# Altium project tetris.PrjPcb
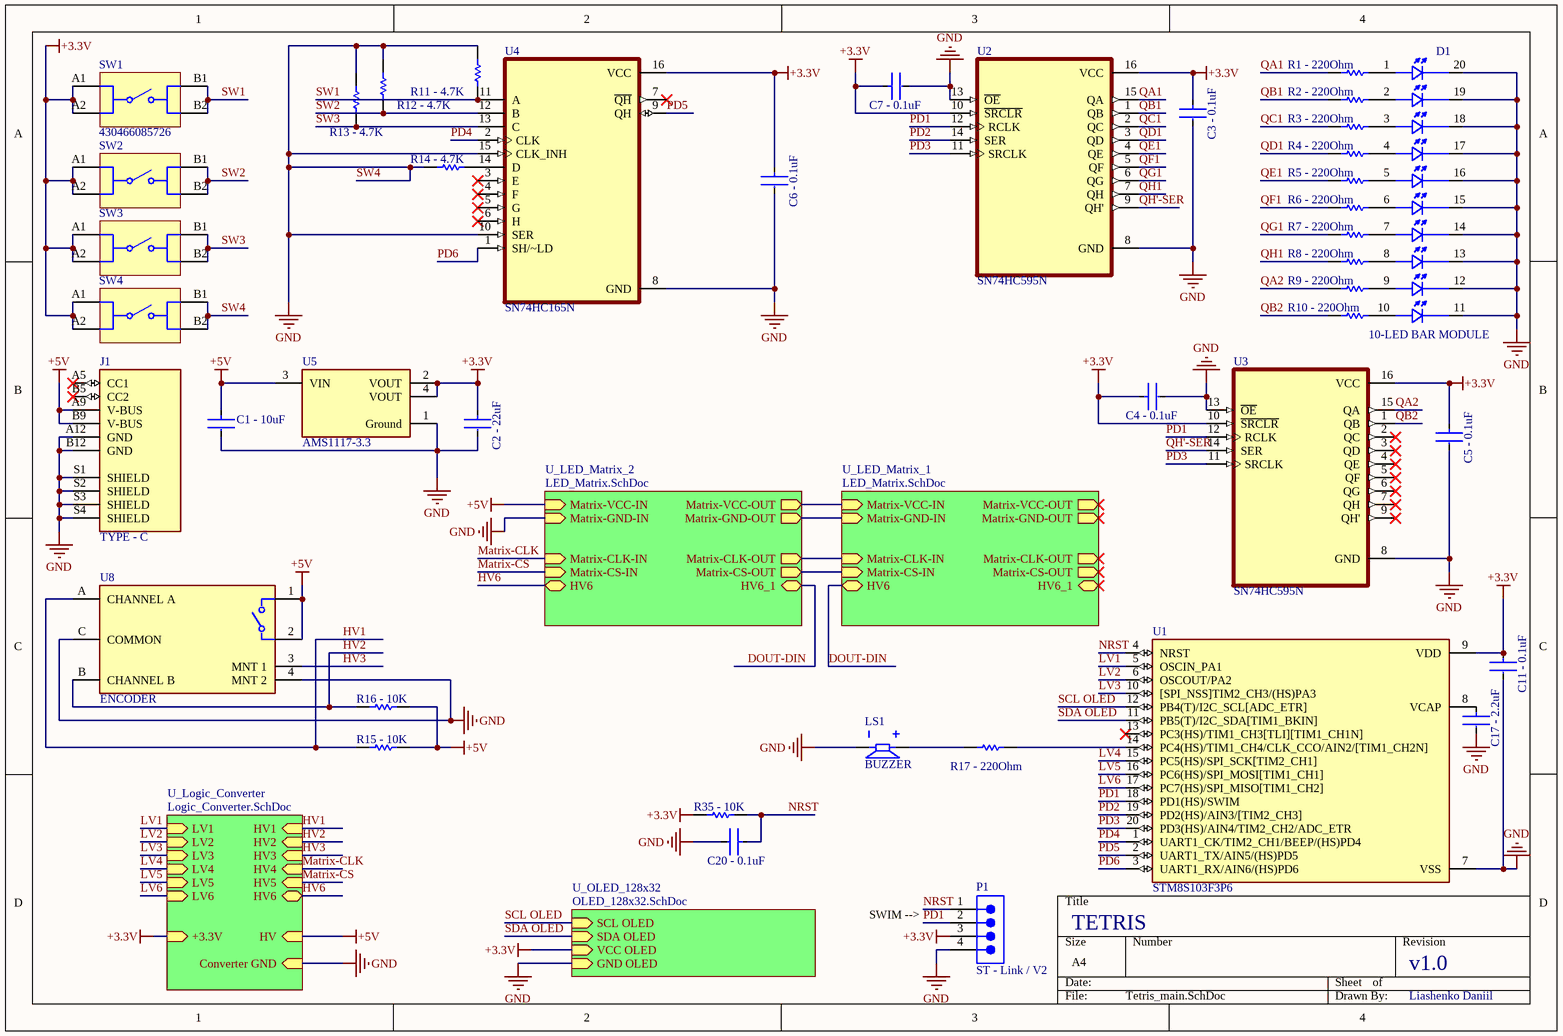
[diagram p0: Tetris_main.SchDoc]
4 sheets, 85 parts. Net scope: hierarchical (ports join the sheet entries above them; power ports are global).
Sheets:
  Tetris_main.SchDoc
    U_Logic_Converter = Logic_Converter.SchDoc
    U_OLED_128x32 = OLED_128x32.SchDoc
    U_LED_Matrix_1 = LED_Matrix.SchDoc
    U_LED_Matrix_2 = LED_Matrix.SchDoc

## Sheet Tetris_main.SchDoc
size A4; SheetNumber: 1; SheetTotal: 4

### Parts
C1_-_10uF  GRM188R60J106ME47D  [FP-GRM188-0_1-e0_2_0_55-IPC_A]  (value not drawn)
C2_-_22uF  CC0603MRX5R5BB226  [FP-CC0603-DC-MFG]  (value not drawn)
C3_-_0.1uF  CC0603KRX7R7BB104  [FP-CC0603-DA-MFG]  (value not drawn)
C4_-_0.1uF  CC0603KRX7R7BB104  [FP-CC0603-DA-MFG]  (value not drawn)
C5_-_0.1uF  CC0603KRX7R7BB104  [FP-CC0603-DA-MFG]  (value not drawn)
C6_-_0.1uF  CC0603KRX7R7BB104  [FP-CC0603-DA-MFG]  (value not drawn)
C7_-_0.1uF  CC0603KRX7R7BB104  [FP-CC0603-DA-MFG]  (value not drawn)
C11_-_0.1uF  CC0603KRX7R7BB104  [FP-CC0603-DA-MFG]  (value not drawn)
C17_-_2.2uF  CC0805KKX7R7BB105  [FP-CC0805-0_85-MFG]  (value not drawn)
C20_-_0.1uF  CC0603KRX7R7BB104  [FP-CC0603-DA-MFG]  (value not drawn)
D1  10-LED BAR MODULE  [DIP750W50P254L2540H825Q20]
J1  TYPE - C  [CUI_UJC-HP-3-SMT-TR]
LS1  BUZZER  [XDCR_CPI-148-24-90T-67]
P1  ST - Link / V2  [61300411021]
R1_-_220Ohm  RC0402FR-13220RL  [RESC1005X40X25ML05T10]  (value not drawn)
R2_-_220Ohm  RC0402FR-13220RL  [RESC1005X40X25ML05T10]  (value not drawn)
R3_-_220Ohm  RC0402FR-13220RL  [RESC1005X40X25ML05T10]  (value not drawn)
R4_-_220Ohm  RC0402FR-13220RL  [RESC1005X40X25ML05T10]  (value not drawn)
R5_-_220Ohm  RC0402FR-13220RL  [RESC1005X40X25ML05T10]  (value not drawn)
R6_-_220Ohm  RC0402FR-13220RL  [RESC1005X40X25ML05T10]  (value not drawn)
R7_-_220Ohm  RC0402FR-13220RL  [RESC1005X40X25ML05T10]  (value not drawn)
R8_-_220Ohm  RC0402FR-13220RL  [RESC1005X40X25ML05T10]  (value not drawn)
R9_-_220Ohm  RC0402FR-13220RL  [RESC1005X40X25ML05T10]  (value not drawn)
R10_-_220Ohm  RC0402FR-13220RL  [RESC1005X40X25ML05T10]  (value not drawn)
R11_-_4.7K  RC0603JR-074K7L  [RESC1608X55X25ML10T15]  (value not drawn)
R12_-_4.7K  RC0603JR-074K7L  [RESC1608X55X25ML10T15]  (value not drawn)
R13_-_4.7K  RC0603JR-074K7L  [RESC1608X55X25ML10T15]  (value not drawn)
R14_-_4.7K  RC0603JR-074K7L  [RESC1608X55X25ML10T15]  (value not drawn)
R15_-_10K  RC0603JR-074K7L  [RESC1608X55X25ML10T15]  (value not drawn)
R16_-_10K  RC0603JR-074K7L  [RESC1608X55X25ML10T15]  (value not drawn)
R17_-_220Ohm  RC0402FR-13220RL  [RESC1005X40X25ML05T10]  (value not drawn)
R35_-_10K  RC0603JR-074K7L  [RESC1608X55X25ML10T15]  (value not drawn)
SW1  430466085726  [430466085726]
SW2  430466085726  [430466085726]  (value not drawn)
SW3  430466085726  [430466085726]  (value not drawn)
SW4  430466085726  [430466085726]  (value not drawn)
U1  STM8S103F3P6  [SOP65P640X120-20N]
U2  SN74HC595N  [DIP794W45P254L1969H508Q16]
U3  SN74HC595N  [DIP794W45P254L1969H508Q16]
U4  SN74HC165N  [DIP794W45P254L1969H508Q16]
U5  AMS1117-3.3  [FP-AMS1117-IPC_B]
U8  ENCODER  [FP-PEC11R-4115F-S0018-MFG]

### Sub-sheets
U_LED_Matrix_1 = LED_Matrix.SchDoc: Matrix-CLK-IN (in), Matrix-CS-IN (in), HV6 (bidir), HV6_1 (bidir), Matrix-GND-IN (in), Matrix-GND-OUT (out), Matrix-CLK-OUT (out), Matrix-CS-OUT (out), Matrix-VCC-IN (in), Matrix-VCC-OUT (out)
U_LED_Matrix_2 = LED_Matrix.SchDoc: Matrix-CLK-IN (in), Matrix-CS-IN (in), HV6 (bidir), HV6_1 (bidir), Matrix-GND-IN (in), Matrix-GND-OUT (out), Matrix-CLK-OUT (out), Matrix-CS-OUT (out), Matrix-VCC-IN (in), Matrix-VCC-OUT (out)
U_Logic_Converter = Logic_Converter.SchDoc: LV1 (in), HV1 (in), LV2 (in), HV2 (in), LV3 (in), HV3 (in), LV4 (in), HV4 (in), LV5 (in), HV5 (in), LV6 (in), HV6 (bidir), +3.3V (in), HV (in), Converter GND (in)
U_OLED_128x32 = OLED_128x32.SchDoc: SCL OLED (in), SDA OLED (in), VCC OLED (in), GND OLED (in)

### Nets
+3.3V: C1_-_10uF.1 C2_-_22uF.1 C3_-_0.1uF.1 C4_-_0.1uF.1 C5_-_0.1uF.1 C6_-_0.1uF.1 C7_-_0.1uF.1 C11_-_0.1uF.1 J1.A9(V-BUS) J1.B9(V-BUS) P1.3 R15_-_10K.2 R16_-_10K.2 R35_-_10K.1 SW1.A1 SW1.A2 SW2.A1 SW2.A2 SW3.A1 SW3.A2 SW4.A1 SW4.A2 U1.9(VDD) U2.10(~{SRCLR}) U2.16(VCC) U3.10(~{SRCLR}) U3.16(VCC) U4.16(VCC) U5.2(VOUT) U5.3(VIN) U5.4(VOUT) U8.1 U8.2 ; sheet U_Logic_Converter/+3.3V, sheet U_Logic_Converter/HV, sheet U_OLED_128x32/VCC OLED, sheet U_LED_Matrix_1/Matrix-VCC-IN, sheet U_LED_Matrix_1/Matrix-VCC-OUT, sheet U_LED_Matrix_2/Matrix-VCC-IN, sheet U_LED_Matrix_2/Matrix-VCC-OUT  [also labelled +5V]
GND: C1_-_10uF.2 C2_-_22uF.2 C3_-_0.1uF.2 C4_-_0.1uF.2 C5_-_0.1uF.2 C6_-_0.1uF.2 C7_-_0.1uF.2 C11_-_0.1uF.2 C17_-_2.2uF.2 C20_-_0.1uF.2 D1.11 D1.12 D1.13 D1.14 D1.15 D1.16 D1.17 D1.18 D1.19 D1.20 J1.A12(GND) J1.B12(GND) J1.S1(SHIELD) J1.S2(SHIELD) J1.S3(SHIELD) J1.S4(SHIELD) LS1.N P1.4 R11_-_4.7K.2 R12_-_4.7K.2 R13_-_4.7K.2 R14_-_4.7K.1 SW4.B1 SW4.B2 U1.7(VSS) U2.8(GND) U2.13(~{OE}) U3.8(GND) U3.13(~{OE}) U4.8(GND) U4.10(SER) U4.15(CLK_INH) U5.1(Ground) U8.4(MNT_2) U8.C(COMMON) ; sheet U_Logic_Converter/Converter GND, sheet U_OLED_128x32/GND OLED, sheet U_LED_Matrix_1/Matrix-GND-IN, sheet U_LED_Matrix_1/Matrix-GND-OUT, sheet U_LED_Matrix_2/Matrix-GND-IN, sheet U_LED_Matrix_2/Matrix-GND-OUT  [also labelled SW4]
HV1: R15_-_10K.1 U8.A(CHANNEL_A) ; sheet U_Logic_Converter/HV1
HV2: R16_-_10K.1 U8.B(CHANNEL_B) ; sheet U_Logic_Converter/HV2
HV3: U8.3(MNT_1) ; sheet U_Logic_Converter/HV3
HV6: sheet U_Logic_Converter/HV6, sheet U_LED_Matrix_2/HV6
LV1: U1.5(OSCIN_PA1) ; sheet U_Logic_Converter/LV1
LV2: U1.6(OSCOUT/PA2) ; sheet U_Logic_Converter/LV2
LV3: U1.10([SPI_NSS]TIM2_CH3/(HS)PA3) ; sheet U_Logic_Converter/LV3
LV4: U1.15(PC5(HS)/SPI_SCK[TIM2_CH1]) ; sheet U_Logic_Converter/LV4
LV5: U1.16(PC6(HS)/SPI_MOSI[TIM1_CH1]) ; sheet U_Logic_Converter/LV5
LV6: U1.17(PC7(HS)/SPI_MISO[TIM1_CH2]) ; sheet U_Logic_Converter/LV6
Matrix-CLK: sheet U_Logic_Converter/HV4, sheet U_LED_Matrix_1/Matrix-CLK-IN, sheet U_LED_Matrix_1/Matrix-CLK-OUT, sheet U_LED_Matrix_2/Matrix-CLK-IN, sheet U_LED_Matrix_2/Matrix-CLK-OUT
Matrix-CS: sheet U_Logic_Converter/HV5, sheet U_LED_Matrix_1/Matrix-CS-IN, sheet U_LED_Matrix_1/Matrix-CS-OUT, sheet U_LED_Matrix_2/Matrix-CS-IN, sheet U_LED_Matrix_2/Matrix-CS-OUT
NRST: C20_-_0.1uF.1 P1.1 R35_-_10K.2 U1.4(NRST)
PD1: P1.2 U1.18(PD1(HS)/SWIM) U2.12(RCLK) U3.12(RCLK)
PD2: U1.19(PD2(HS)/AIN3/[TIM2_CH3]) U2.14(SER)
PD3: U1.20(PD3(HS)/AIN4/TIM2_CH2/ADC_ETR) U2.11(SRCLK) U3.11(SRCLK)
PD4: U1.1(UART1_CK/TIM2_CH1/BEEP/(HS)PD4) U4.2(CLK)
PD5: U1.2(UART1_TX/AIN5/(HS)PD5) U4.9(QH)
PD6: U1.3(UART1_RX/AIN6/(HS)PD6) U4.1(SH/~LD)
QA1: R1_-_220Ohm.1 U2.15(QA)
QA2: R9_-_220Ohm.1 U3.15(QA)
QB1: R2_-_220Ohm.1 U2.1(QB)
QB2: R10_-_220Ohm.1 U3.1(QB)
QC1: R3_-_220Ohm.1 U2.2(QC)
QD1: R4_-_220Ohm.1 U2.3(QD)
QE1: R5_-_220Ohm.1 U2.4(QE)
QF1: R6_-_220Ohm.1 U2.5(QF)
QG1: R7_-_220Ohm.1 U2.6(QG)
QH1: R8_-_220Ohm.1 U2.7(QH)
QH'-SER: U2.9(QH') U3.14(SER)
SCL OLED: U1.12(PB4(T)/I2C_SCL[ADC_ETR]) ; sheet U_OLED_128x32/SCL OLED
SDA OLED: U1.11(PB5(T)/I2C_SDA[TIM1_BKIN]) ; sheet U_OLED_128x32/SDA OLED
SW1: R11_-_4.7K.1 SW1.B1 SW1.B2 U4.11(A)
SW2: R12_-_4.7K.1 SW2.B1 SW2.B2 U4.12(B)
SW3: R13_-_4.7K.1 SW3.B1 SW3.B2 U4.13(C)
NetC17_-_2.2uF_1: C17_-_2.2uF.1 U1.8(VCAP)
NetD1_1: D1.1 R1_-_220Ohm.2
NetD1_2: D1.2 R2_-_220Ohm.2
NetD1_3: D1.3 R3_-_220Ohm.2
NetD1_4: D1.4 R4_-_220Ohm.2
NetD1_5: D1.5 R5_-_220Ohm.2
NetD1_6: D1.6 R6_-_220Ohm.2
NetD1_7: D1.7 R7_-_220Ohm.2
NetD1_8: D1.8 R8_-_220Ohm.2
NetD1_9: D1.9 R9_-_220Ohm.2
NetD1_10: D1.10 R10_-_220Ohm.2
NetLS1_P: LS1.P R17_-_220Ohm.1
NetR14_-_4.7K_2: R14_-_4.7K.2 U4.14(D)
NetR17_-_220Ohm_2: R17_-_220Ohm.2 U1.14(PC4(HS)/TIM1_CH4/CLK_CCO/AIN2/[TIM1_CH2N])

Not connected (* = marked no-connect by the designer): J1 A5(CC1)* B5(CC2)*; U1 13(PC3(HS)/TIM1_CH3[TLI][TIM1_CH1N])*; U3 2(QC)* 3(QD)* 4(QE)* 5(QF)* 6(QG)* 7(QH)* 9(QH')*; U4 3(E)* 4(F)* 5(G)* 6(H)* 7(~{QH})*

### Notes on the sheet
- DOUT-DIN
- SWIM -->
- (near U1) TETRIS
- v1.0
- Liashenko Daniil

### Library data of the parts
C1_-_10uF = CMP-2006-02792-2: Chip Multilayer Ceramic Capacitors for General Purpose, 0603, 10uF, X5R, 15%, 20%, 6.3V; Packaging: Tape and Reel; Voltage Rating (DC): 6.3V; Width: 0.031inch; Termination: SMD/SMT; Dielectric: X5R; Package Quantity: 4000; Voltage Rating: 6.3V; Capacitance: 10uF; Case/Package: 0603; Min Operating Temperature: -55°C; Voltage: 6.3V; Length: 1.6mm; Thickness: 0.035inch; Lead Free: Lead Free; Depth: 0.8mm; Case Code (Imperial): 0603; Max Operating Temperature: 85°C; Material: Ceramic; Height: 0.8mm; Tolerance: 20%; Mount: Surface Mount; REACH SVHC: No SVHC; Radiation Hardening: No; Case Code (Metric): 1608
C2_-_22uF = CMP-2000-06075-2: CAP CER 22UF 6.3V X5R 0603; Tolerance: 20%; Termination: SMD/SMT; Mount: Surface Mount; Depth: 0.8mm; Thickness: 0.035inch; Packaging: Tape and Reel; RoHS Compliant: Yes; Case/Package: 0603; Min Operating Temperature: -55°C; Package Quantity: 4000; Weight: 7.1E-05oz; Max Operating Temperature: 85°C; Voltage Rating (DC): 6.3V; Halogen Free: Halogen Free; Lead Free: Lead Free; Resistor Type: Ceramic; Case Code (Imperial): 0603; Width: 0.031inch; Case Code (Metric): 1608; Voltage Rating: 6.3V; Length: 0.063inch; Capacitance: 22uF; Dielectric: X5R
C3_-_0.1uF C4_-_0.1uF C5_-_0.1uF C6_-_0.1uF C7_-_0.1uF C11_-_0.1uF C20_-_0.1uF = CMP-2000-05002-2: CAP CER 0.1UF 16V X7R 0603; Manufacturer: YAGEO; Tolerance: 0.1; Value: 100 nF; Temperature Coefficient: 15%; Material: Ceramic; Voltage Rating: 16 V; Package: CC0603-DA; ComponentLink2Description: Datasheet; Octopart: https://octopart.com/cc0603krx7r7bb104-yageo-192941; Temperature Range High: +125°C; Digikey Description: CAP CER 0.1UF 16V X7R 0603; Voltage: 16 V; Device Class L2: Capacitors; Height: 0.9mm; Temperature: -55°C to +125°C; Manufacturer Part Number: CC0603KRX7R7BB104; Device Class L1: Passive Components; Device Class L3: Ceramic Capacitors; ComponentLink2URL: http://www.yageo.com/documents/recent/UPY-GPHC_X7R_6.3V-to-50V_18.pdf; Footprint Url: http://www.yageo.com/exep/pages/download/literatures/UPY-C_GEN_24.pdf; RoHS: TRUE; Temperature Range Low: -55°C; Temperature Characteristic: X7R; Lead Free: Yes; Capacitance: 100 nF; Category: Cap; Mouser Description: Multilayer Ceramic Capacitor, CC Series, 0.1 - F, - 10%, X7R, 16 V, 0603 [1608 Metric]; Automotive: No
C17_-_2.2uF = CMP-03422-000001-1: CAP CER 1UF 16V X7R 0805; Manufacturer: Yageo; Material: Ceramic; Tolerance: 0.1; Voltage Rating: 16 V; Category: Cap; Capacitance: 1 uF; ComponentLink2Description: Datasheet; Automotive: No; Temperature Range High: +85°C; RoHS: TRUE; Footprint Url: http://www.yageo.com/exep/pages/download/literatures/UPY-C_GEN_24.pdf; Mouser Description: Multilayer Ceramic Capacitors MLCC - SMD/SMT 1.0uF 16V X7R 10%; Height: 0.95mm; Ipc Land Pattern Name: CAPC200125X85; Temperature: -30°C to +85°C; Lead Free: Yes; Value: 1 uF; Temperature Characteristic: X7R; Package: CC0805-0.85; Temperature Range Low: -30°C; Device Class L1: Passive Components; Device Class L3: Ceramic Capacitors; Octopart: https://octopart.com/cc0805kkx7r7bb105-yageo-8376555; Manufacturer Part Number: CC0805KKX7R7BB105; ComponentLink2URL: http://www.yageo.com/documents/recent/UPY-GPHC_Y5V_6.3V-to-50V_8.pdf; Device Class L2: Capacitors; Digikey Description: CAP CER 1UF 16V X7R 0805
D1 = CMP-004-00031-1: LED Circuit Board Indicator Bar - 10 Wide, DIP Red (x 10) Diffused, White 2V 30mA Through Hole; MF: Kingbright; Check_prices: https://www.snapeda.com/parts/DC10EWA/Kingbright/view-part/268697/?ref=eda; Pins: 20; Component Type: Standard; Design Item ID: DC10EWA; Purchase-URL: https://pricing.snapeda.com/search/part/DC10EWA/?ref=eda; Availability: In Stock; MP: DC10EWA; Source: DC10EWA.SchLib; Value: *; Price: None; Case/Package: DIP-20 Kingbright; SnapEDA_Link: https://www.snapeda.com/parts/DC10EWA/Kingbright/view-part/268697/?ref=snap
J1 = CMP-039-000000-1: Source: UJC-HP-3-SMT-TR.SchLib; Package: None; Design Item ID: UJC-HP-3-SMT-TR; Component Type: Standard; Value: *; Availability: Unavailable; Pin Count: 10; MP: UJC-HP-3-SMT-TR; Price: None
LS1 = CMP-037-000000-1: 13,9 РјРј, 24 Р’ РїРѕСЃС‚. С‚РѕРєР°, 90 РґР‘, СЃРєРІРѕР·РЅРѕРµ РѕС‚РІРµСЂСЃС‚РёРµ, РїСЊРµР·РѕСЌР»РµРєС‚СЂРёС‡РµСЃРєРёР№ Р·РІСѓРєРѕРІРѕР№ РёРЅРґРёРєР°С‚РѕСЂ; MF: Same Sky; MP: CPI-148-24-90T-67; Source: CPI-148-24-90T-67.SchLib; SnapEDA_Link: https://www.snapeda.com/parts/CPI-148-24-90T-67/Same+Sky/view-part/?ref=snap; Value: *; Check_prices: https://www.snapeda.com/parts/CPI-148-24-90T-67/Same+Sky/view-part/?ref=eda; Package: None; Design Item ID: CPI-148-24-90T-67; Pin Count: 2; Component Type: Standard
P1 = CMP-043-000000-1: NexarPartId: 31153320; Gender: Male; Number of Positions: 4; Current Rating: 3A; Pitch: 2.54mm; Contact Resistance: 20m?; Connector Type: Male Pin; Operating Supply Voltage: 250V; Contact Mating Length: 5.9944mm; Number of Rows: 1; Contact Plating: Gold; Design Item ID: CMP-1502-01063-3; Lead Pitch: 2.54mm; Component Type: Standard; Number of Pins: 4; Number of Contacts: 4; Mount: Through Hole; REACH SVHC: Unknown; Source: Components - 25.08.25 - 11.48.SchLib; Contact Material: Copper; Pin Count: 4; Termination: Solder; RoHS: Compliant; Color: Black
R1_-_220Ohm R2_-_220Ohm R3_-_220Ohm R4_-_220Ohm R5_-_220Ohm R6_-_220Ohm R7_-_220Ohm R8_-_220Ohm R9_-_220Ohm R10_-_220Ohm R17_-_220Ohm = CMP-2002-07866-1: Manufacturer: Yageo; Part Number: RC0402FR-13220RL
R11_-_4.7K R12_-_4.7K R13_-_4.7K R14_-_4.7K R15_-_10K R16_-_10K R35_-_10K = CMP-2000-05024-1: Chip Resistor, 4.7 KOhm, +/- 5%, 100 mW, -55 to 155 degC, 0603 (1608 Metric), RoHS, Tape and Reel; Manufacturer: Yageo; Resistance: 4.7kOhms; Temperature Coefficient: 100PPM/C; Power Rating: 100mW; Voltage Rating: 50V; Operating Temperature Range: -55Cto+155C; Case Code - mm: 1608; Tolerance: 5%; Product: ThickFilmResistorsGeneralPurpose; Case Code - in: 0603; Datasheet URL: http://www.yageo.com/documents/recent/PYu-RC_Group_51_RoHS_L_04.pdf; Package Reference: 603; Datasheet Version: Rev. 4, 02/2016; Package Description: 2-Pin Surface Mount Device, Body 1.6 x 0.8 mm; Manufacturer URL: http://www.yageo.com/; Series: RC; Packaging: Reel; Termination Style: SMD/SMT
SW1-SW4 = CMP-1456-00006-3: Switch Tactile Spst-no 0.05A 12V; Insulation Resistance: 100MΩ; Contact Current Rating: 50mA; Min Operating Temperature: -40°C; Height: 8.5mm; Contact Plating: Silver; RoHS: Compliant; Color: White; Packaging: Bulk; Voltage Rating: 12V; Max Operating Temperature: 85°C; Current Rating: 50mA
U1 = CMP-031-00026-1: STM8 series Microcontroller IC 8-Bit 16MHz 8KB (8K x 8) FLASH 20-TSSOP; MF: STMicroelectronics; MP: STM8S103F3P6; Case/Package: TSSOP-20 STMicroelectronics; Check_prices: https://www.snapeda.com/parts/STM8S103F3P6/STMicroelectronics/view-part/?ref=eda; Pins: 20; SnapEDA_Link: https://www.snapeda.com/parts/STM8S103F3P6/STMicroelectronics/view-part/?ref=snap; Component Type: Standard; Design Item ID: STM8S103F3P6; Value: *; Source: STM8S103F3P6.SchLib
U2 U3 = CMP-029-000000-1: 8-bit shift registers with 3-state output registers; MF: Texas Instruments; Source: SN74HC595N.SchLib; Design Item ID: SN74HC595N; Value: *; Package: PDIP-16 Texas Instruments; Check_prices: https://www.snapeda.com/parts/SN74HC595N/Texas+Instruments/view-part/?ref=eda; Component Type: Standard; MP: SN74HC595N; SnapEDA_Link: https://www.snapeda.com/parts/SN74HC595N/Texas+Instruments/view-part/?ref=snap; Pin Count: 16
U4 = CMP-031-000000-4: 8-Bit Parallel-Load Shift Registers; MF: Texas Instruments; Value: *; SnapEDA_Link: https://www.snapeda.com/parts/SN74HC165N/Texas+Instruments/view-part/?ref=snap; Source: SN74HC165N.SchLib; MP: SN74HC165N; Check_prices: https://www.snapeda.com/parts/SN74HC165N/Texas+Instruments/view-part/?ref=eda; Pin Count: 16; Package: PDIP-16 Texas Instruments; Component Type: Standard; Design Item ID: SN74HC165N
U5 = CMP-012-00000-1: Fixed Positive LDO Regulator, 3.3V, 1.3V Dropout, PDSO3; Package Body Material: Plastic; Channels: 1; Regulator Type: FIXED POSITIVE SINGLE OUTPUT LDO REGULATOR; Output Voltage1-Max: 3.399V; Output Current1-Max: 1A; Output Voltage1-Min: 3.201V; Height - Seated (Max): 1.8mm; Reach SVHC Compliant: Yes; Terminal Pitch: 2.29mm; Operating Temperature, TJ-Min: -40°C; Package Shape: Rectangular; RoHS Compliant: Yes; Case/Package: SOP; JESD-30 Code: R-PDSO-G3; Pins: 3; Dropout Voltage1-Max: 1.3V; Terminal Position: DUAL; Surface Mount: Yes; Package Style: SMALL OUTLINEMeter; Operating Temperature, TJ-Max: 125°C; Width: 3.505mm; Output Voltage1-Nom: 3.3V; Terminal Form: Gull Wing; Length: 6.505mm
U8 = CMP-07421-000064-1: ROTARY ENCODER MECHANICAL 18PPR; Hole Diameter: 1.8mm; Output Type: Quadrature; Number of Channels: 2; Detent: Yes; Pulses per Revolution: 18; Height: 13.4mm; Min Operating Temperature: -30°C; Radiation Hardening: No; Series: PEC11R; Max Operating Temperature: 70°C; Package Quantity: 150; Built in Switch: Yes; Mount: Through Hole; Packaging: Bulk; Termination: PC Pins; Number of Pins: 5; REACH SVHC: No SVHC; Width: 12.5mm; Encoder Type: Mechanical; Length: 21.5mm; RoHS Compliant: Yes; Orientation: Vertical

## Sheet Logic_Converter.SchDoc
size A4; SheetNumber: 4; SheetTotal: 4
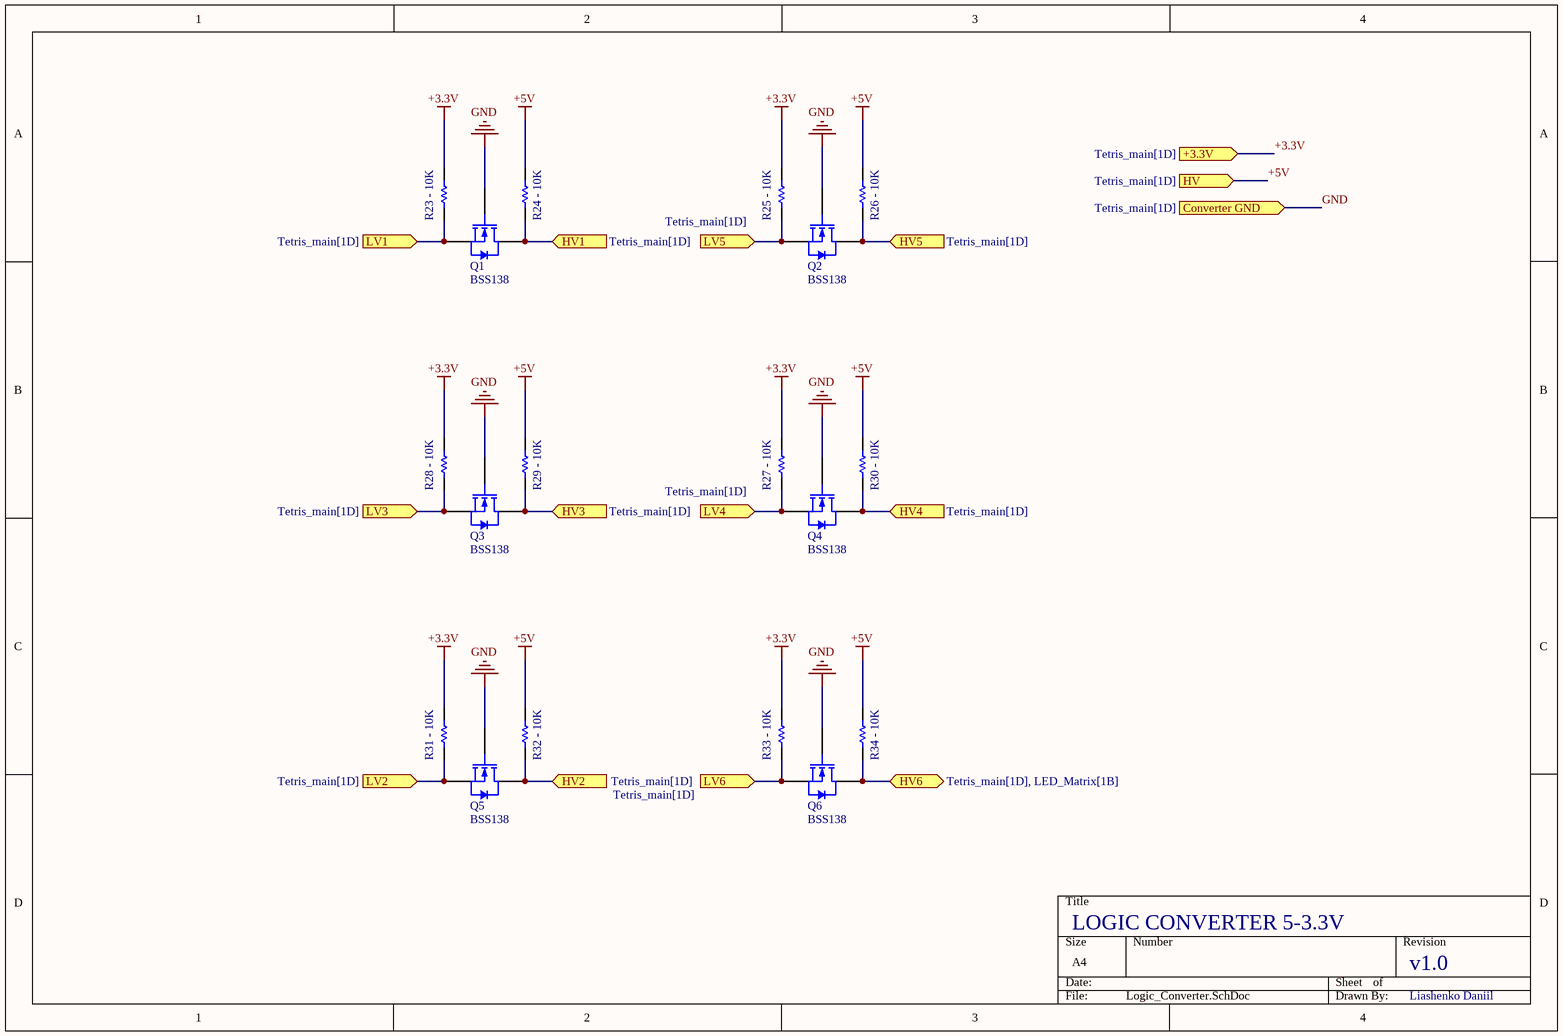
[diagram p1: Logic_Converter.SchDoc]

### Parts
Q1  BSS138  [FAIR-SOT23-3_V]
Q2  BSS138  [FAIR-SOT23-3_V]
Q3  BSS138  [FAIR-SOT23-3_V]
Q4  BSS138  [FAIR-SOT23-3_V]
Q5  BSS138  [FAIR-SOT23-3_V]
Q6  BSS138  [FAIR-SOT23-3_V]
R23_-_10K  RC0603JR-074K7L  [RESC1608X55X25ML10T15]  (value not drawn)
R24_-_10K  RC0603JR-074K7L  [RESC1608X55X25ML10T15]  (value not drawn)
R25_-_10K  RC0603JR-074K7L  [RESC1608X55X25ML10T15]  (value not drawn)
R26_-_10K  RC0603JR-074K7L  [RESC1608X55X25ML10T15]  (value not drawn)
R27_-_10K  RC0603JR-074K7L  [RESC1608X55X25ML10T15]  (value not drawn)
R28_-_10K  RC0603JR-074K7L  [RESC1608X55X25ML10T15]  (value not drawn)
R29_-_10K  RC0603JR-074K7L  [RESC1608X55X25ML10T15]  (value not drawn)
R30_-_10K  RC0603JR-074K7L  [RESC1608X55X25ML10T15]  (value not drawn)
R31_-_10K  RC0603JR-074K7L  [RESC1608X55X25ML10T15]  (value not drawn)
R32_-_10K  RC0603JR-074K7L  [RESC1608X55X25ML10T15]  (value not drawn)
R33_-_10K  RC0603JR-074K7L  [RESC1608X55X25ML10T15]  (value not drawn)
R34_-_10K  RC0603JR-074K7L  [RESC1608X55X25ML10T15]  (value not drawn)

### Ports
+3.3V (in, see Tetris_main[1D]), Converter GND (in, see Tetris_main[1D]), HV1 (in, see Tetris_main[1D]), HV2 (in, see Tetris_main[1D]), HV3 (in, see Tetris_main[1D]), HV4 (in, see Tetris_main[1D]), HV5 (in, see Tetris_main[1D]), HV6 (bidir, see Tetris_main[1D], LED_Matrix[1B]), HV (in, see Tetris_main[1D]), LV1 (in, see Tetris_main[1D]), LV2 (in, see Tetris_main[1D]), LV3 (in, see Tetris_main[1D]), LV4 (in, see Tetris_main[1D]), LV5 (in, see Tetris_main[1D]), LV6 (in, see Tetris_main[1D])

### Nets
+3.3V: R23_-_10K.2 R24_-_10K.2 R25_-_10K.2 R26_-_10K.2 R27_-_10K.2 R28_-_10K.2 R29_-_10K.2 R30_-_10K.2 R31_-_10K.2 R32_-_10K.2 R33_-_10K.2 R34_-_10K.2 ; port +3.3V, port HV  [also labelled +5V]
GND: Q1.1(G) Q2.1(G) Q3.1(G) Q4.1(G) Q5.1(G) Q6.1(G) ; port Converter GND
HV1: Q1.3(D) R24_-_10K.1 ; port HV1
HV2: Q5.3(D) R32_-_10K.1 ; port HV2
HV3: Q3.3(D) R29_-_10K.1 ; port HV3
HV6: Q6.3(D) R34_-_10K.1 ; port HV6
LV1: Q1.2(S) R23_-_10K.1 ; port LV1
LV2: Q5.2(S) R31_-_10K.1 ; port LV2
LV3: Q3.2(S) R28_-_10K.1 ; port LV3
LV4: Q4.2(S) R27_-_10K.1 ; port LV4
LV5: Q2.2(S) R25_-_10K.1 ; port LV5
LV6: Q6.2(S) R33_-_10K.1 ; port LV6
Matrix-CLK: Q4.3(D) R30_-_10K.1 ; port HV4
Matrix-CS: Q2.3(D) R26_-_10K.1 ; port HV5

### Notes on the sheet
- LOGIC CONVERTER 5-3.3V
- v1.0
- Liashenko Daniil

### Library data of the parts
Q1-Q6 = CMP-013-00021-4: N-Channel Logic Level Enhancement Mode Field Effect Transistor, 220 mA, 50 V, -55 to 150 degC, 3-Pin SOT-23, RoHS, Tape and Reel; Manufacturer: Fairchild; Elements: 1; Nominal Vgs: 1.3V; Resistance: 0.7Ohm; Typical Rise Time: 9ns; Rds On Max: 3.5Ohm; Nominal Dual Supply Voltage: 50V; Input Capacitance: 27pF; Package Version: Rev. 12, 03/2016; Power: 360mW; Packaging: TapeandReel; Package Description: 3-Pin Small Outline Transistor, Body 2.92 x 1.325 mm, Pitch 0.95 mm; Datasheet URL: https://www.fairchildsemi.com/datasheets/BS/BSS138.pdf; Min Operating Temperature: -55°C; Pins: 3; RoHS Compliant: True; Package Reference: SOT23-3; Package Quantity: 1; Case/Package: TO-236-3; Mounting Technology: SM; Max Operating Temperature: 150°C; Datasheet Version: Rev. C, 10/2005
R23_-_10K R24_-_10K R25_-_10K R26_-_10K R27_-_10K R28_-_10K R29_-_10K R30_-_10K R31_-_10K R32_-_10K R33_-_10K R34_-_10K = CMP-2000-05024-1: as R11_-_4.7K on sheet Tetris_main; Operating Temperature Range: -55Cto+155C; Case Code - mm: 1608; Tolerance: 5%; Product: ThickFilmResistorsGeneralPurpose; Case Code - in: 0603; Datasheet URL: http://www.yageo.com/documents/recent/PYu-RC_Group_51_RoHS_L_04.pdf; Package Reference: 603; Datasheet Version: Rev. 4, 02/2016; Package Description: 2-Pin Surface Mount Device, Body 1.6 x 0.8 mm; Manufacturer URL: http://www.yageo.com/; Series: RC; Packaging: Reel; Termination Style: SMD/SMT

## Sheet OLED_128x32.SchDoc
size A4; SheetNumber: 3; SheetTotal: 4
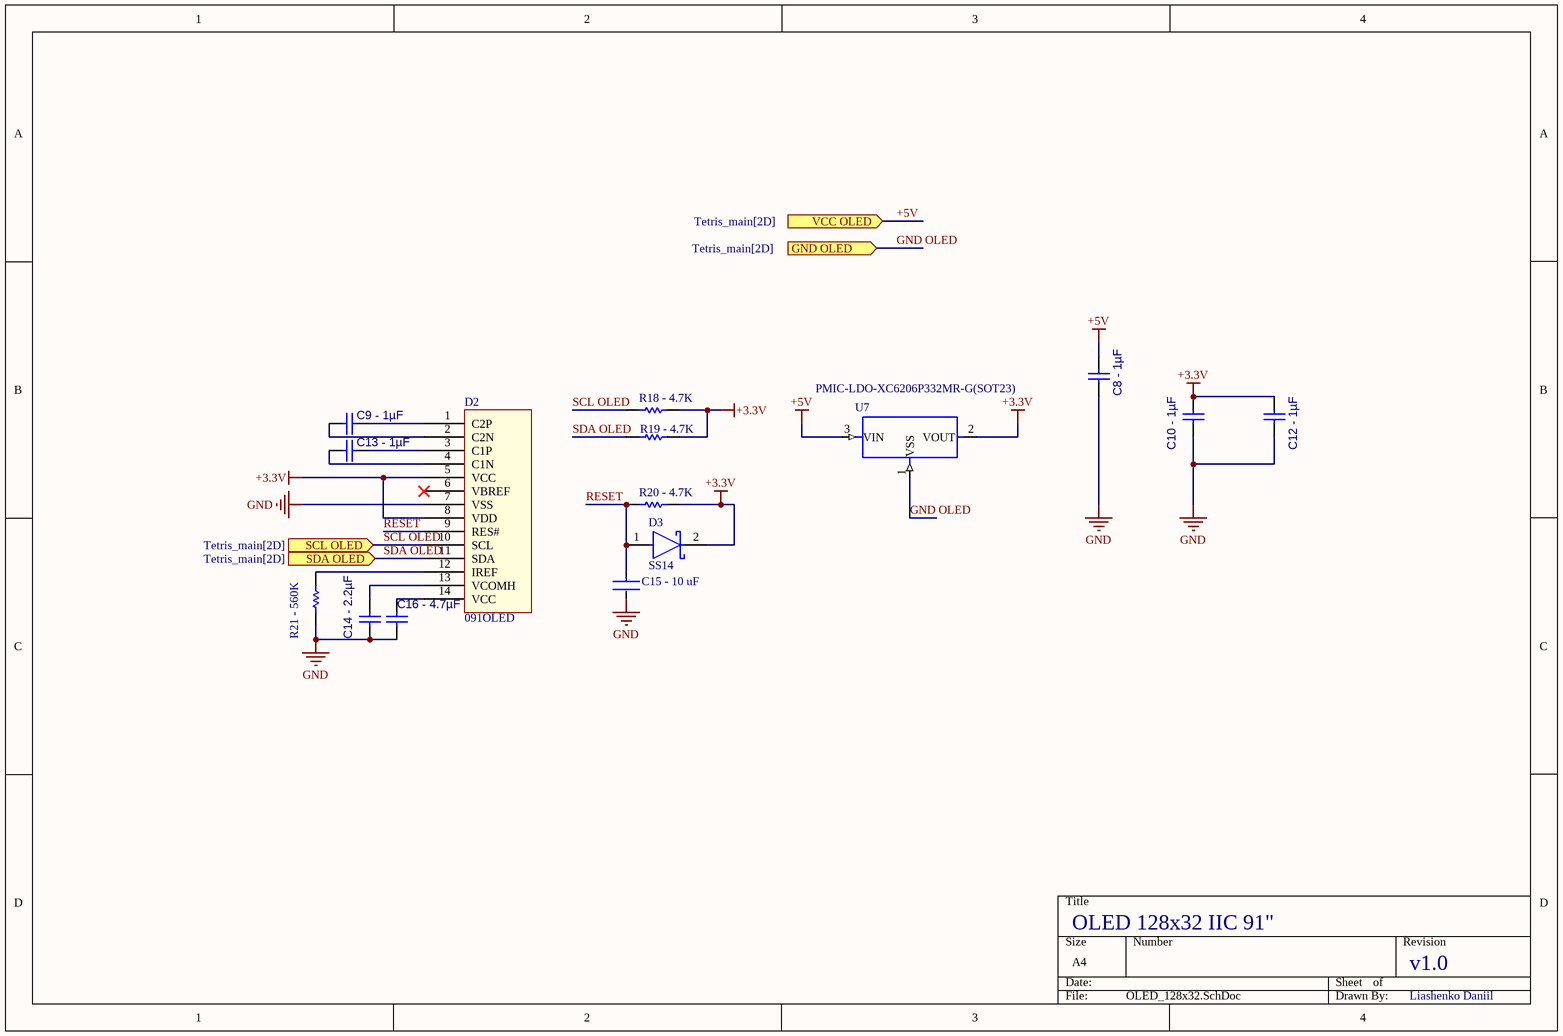
[diagram p2: OLED_128x32.SchDoc]

### Parts
C8_-_1µF  Capacitor 1uF +/- 10% 16V 0603  [CAPC1608X90X35ML15T15]  (value not drawn)
C9_-_1µF  Capacitor 1uF +/- 10% 16V 0603  [CAPC1608X90X35ML15T15]  (value not drawn)
C10_-_1µF  Capacitor 1uF +/- 10% 16V 0603  [CAPC1608X90X35ML15T15]  (value not drawn)
C12_-_1µF  Capacitor 1uF +/- 10% 16V 0603  [CAPC1608X90X35ML15T15]  (value not drawn)
C13_-_1µF  Capacitor 1uF +/- 10% 16V 0603  [CAPC1608X90X35ML15T15]  (value not drawn)
C14_-_2.2µF  Capacitor 2,2µF +/-20% 10V 0402  [CAPC0402(1005)60_L]  (value not drawn)
C15_-_10_uF  GRM188R60J106ME47D  [FP-GRM188-0_1-e0_2_0_55-IPC_A]  (value not drawn)
C16_-_4.7µF  Capacitor 4.7µF +/-20% 10V 0603  [CAPC0603(1608)100_L]  (value not drawn)
D2  091OLED  [091OLED]
D3  SS14  [FP-403AE-MFG]
R18_-_4.7K  RC0603JR-074K7L  [RESC1608X55X25ML10T15]  (value not drawn)
R19_-_4.7K  RC0603JR-074K7L  [RESC1608X55X25ML10T15]  (value not drawn)
R20_-_4.7K  RC0603JR-074K7L  [RESC1608X55X25ML10T15]  (value not drawn)
R21_-_560K  ERA6AEB564V  [RESC2013X60X40ML20T25]  (value not drawn)
U7  PMIC-LDO-XC6206P332MR-G(SOT23)  [SOT-23]

### Ports
GND OLED (in, see Tetris_main[2D]), SCL OLED (in, see Tetris_main[2D]), SDA OLED (in, see Tetris_main[2D]), VCC OLED (in, see Tetris_main[2D])

### Nets
+3.3V: C8_-_1µF.1 C10_-_1µF.1 C12_-_1µF.1 D2.5(VCC) D2.8(VDD) D3.2(C) R18_-_4.7K.1 R19_-_4.7K.1 R20_-_4.7K.1 U7.2(VOUT) U7.3(VIN) ; port VCC OLED  [also labelled +5V]
GND: C8_-_1µF.2 C10_-_1µF.2 C12_-_1µF.2 C14_-_2.2µF.2 C15_-_10_uF.2 C16_-_4.7µF.1 D2.7(VSS) R21_-_560K.1 U7.1(VSS) ; port GND OLED  [also labelled GND OLED]
RESET: C15_-_10_uF.1 D2.9(RES#) D3.1(A) R20_-_4.7K.2
SCL OLED: D2.10(SCL) R18_-_4.7K.2 ; port SCL OLED
SDA OLED: D2.11(SDA) R19_-_4.7K.2 ; port SDA OLED
NetC9_-_1µF_1: C9_-_1µF.1 D2.1(C2P)
NetC9_-_1µF_2: C9_-_1µF.2 D2.2(C2N)
NetC13_-_1µF_1: C13_-_1µF.1 D2.3(C1P)
NetC13_-_1µF_2: C13_-_1µF.2 D2.4(C1N)
NetC14_-_2.2µF_1: C14_-_2.2µF.1 D2.13(VCOMH)
NetC16_-_4.7µF_2: C16_-_4.7µF.2 D2.14(VCC)
NetD2_12: D2.12(IREF) R21_-_560K.2

Not connected (* = marked no-connect by the designer): D2 6(VBREF)*

### Notes on the sheet
- OLED 128x32 IIC 91"
- v1.0
- Liashenko Daniil

### Library data of the parts
C8_-_1µF C9_-_1µF C10_-_1µF C12_-_1µF C13_-_1µF = CMP-001-00004-6: Chip Capacitor, 1 uF, +/- 10%, 16 V, 0603 (1608 Metric); Capacitor Type: Ceramic; Mounting Technology: SM; RoHS Compliant: True; Min Operating Temperature: -55°C; Case/Package: 0603; Pins: 2; Voltage Rating: 16V; Max Operating Temperature: 125°C; Tolerance: 10%
C14_-_2.2µF = CMP-001-00056-4: Chip Capacitor, 2,2µF +/-20%, 10V, 0402, Thickness 0.6 mm; Tolerance: 10%; Mounting Technology: SMT; Max Operating Temperature: 85°C; Case/Package: 0402; Pins: 2; Min Operating Temperature: -55°C; Voltage Rating: 10V
C15_-_10_uF = CMP-2006-02792-2: as C1_-_10uF on sheet Tetris_main; Packaging: Tape and Reel; Voltage Rating (DC): 6.3V; Width: 0.031inch; Termination: SMD/SMT; Dielectric: X5R; Package Quantity: 4000; Voltage Rating: 6.3V; Capacitance: 10uF; Case/Package: 0603; Min Operating Temperature: -55°C; Voltage: 6.3V; Length: 1.6mm; Thickness: 0.035inch; Lead Free: Lead Free; Depth: 0.8mm; Case Code (Imperial): 0603; Max Operating Temperature: 85°C; Material: Ceramic; Height: 0.8mm; Tolerance: 20%; Mount: Surface Mount; REACH SVHC: No SVHC; Radiation Hardening: No; Case Code (Metric): 1608
C16_-_4.7µF = CMP-001-00076-4: Chip Capacitor, 4.7µF +/-20%, 10V, 0603, Thickness 1 mm; Tolerance: 10%; Mounting Technology: SMT; Case/Package: 0603; Pins: 2; Min Operating Temperature: -55°C; Max Operating Temperature: 85°C; Voltage Rating: 10V
D2 = CMP-004-00034-1: Design Item ID: 091OLED; Source: 0.91inch_OLED_Schematic_Package_Library.SCHLIB
D3 = CMP-2000-04943-2: DIODE SCHOTTKY 40V 1A SMA; Manufacturer: ON Semiconductor; Peak Reverse Current: 0.2mA; Max Junction Temp: +125°C; Standoff Height: 0.05mm; Max Surge Forward Current: 40A; Mouser Description: Schottky Diodes & Rectifiers SMA 40V 1.0A; RoHS: TRUE; Lead Free: Yes; Manufacturer Part Number: SS14; Device Class L3: Schottky Diodes; Category: Diode; Automotive: No; Digikey Description: DIODE SCHOTTKY 40V 1A SMA; ComponentLink2Description: Datasheet; Device Class L2: Diodes; Height: 2.5mm; Temperature Range High: +125°C; ComponentLink2URL: https://www.onsemi.com/pub/Collateral/SS19-D.PDF; Device Class L1: Discrete Semiconductors; Package: 403AE; Octopart: https://octopart.com/ss14-on+semiconductor-29205033; Max Repetitive Reverse Voltage: 40V; Temperature Range Low: -65°C; Forward Current: 1A; Temperature: -65°C to +125°C
R18_-_4.7K R19_-_4.7K R20_-_4.7K = CMP-2000-05024-1: as R11_-_4.7K on sheet Tetris_main; Operating Temperature Range: -55Cto+155C; Case Code - mm: 1608; Tolerance: 5%; Product: ThickFilmResistorsGeneralPurpose; Case Code - in: 0603; Datasheet URL: http://www.yageo.com/documents/recent/PYu-RC_Group_51_RoHS_L_04.pdf; Package Reference: 603; Datasheet Version: Rev. 4, 02/2016; Package Description: 2-Pin Surface Mount Device, Body 1.6 x 0.8 mm; Manufacturer URL: http://www.yageo.com/; Series: RC; Packaging: Reel; Termination Style: SMD/SMT
R21_-_560K = CMP-2001-00655-1: Manufacturer: Panasonic; Part Number: ERA6AEB564V
U7 = CMP-031-00015-5: Linear Voltage Regulator IC Positive Fixed 1 Output 200mA SOT-23; MF: Torex; Price: None; Source: PMIC-LDO-XC6206P332MR-G(SOT23).SchLib; MP: XC6206P332MR-G; Check_prices: https://www.snapeda.com/parts/XC6206P332MR-G/Torex/view-part/?ref=eda; Case/Package: SOT-23-3 Torex; SnapEDA_Link: https://www.snapeda.com/parts/XC6206P332MR-G/Torex/view-part/?ref=snap; Availability: In Stock; Value: *; Design Item ID: PMIC-LDO-XC6206P332MR-G(SOT23); Component Type: Standard; Pins: 3; Purchase-URL: https://pricing.snapeda.com/search/part/XC6206P332MR-G/?ref=eda

## Sheet LED_Matrix.SchDoc
size A4; SheetNumber: 2; SheetTotal: 4
Used 2 times, as channels U_LED_Matrix_1, U_LED_Matrix_2. Parts and nets are listed once, with the designators drawn on the sheet.
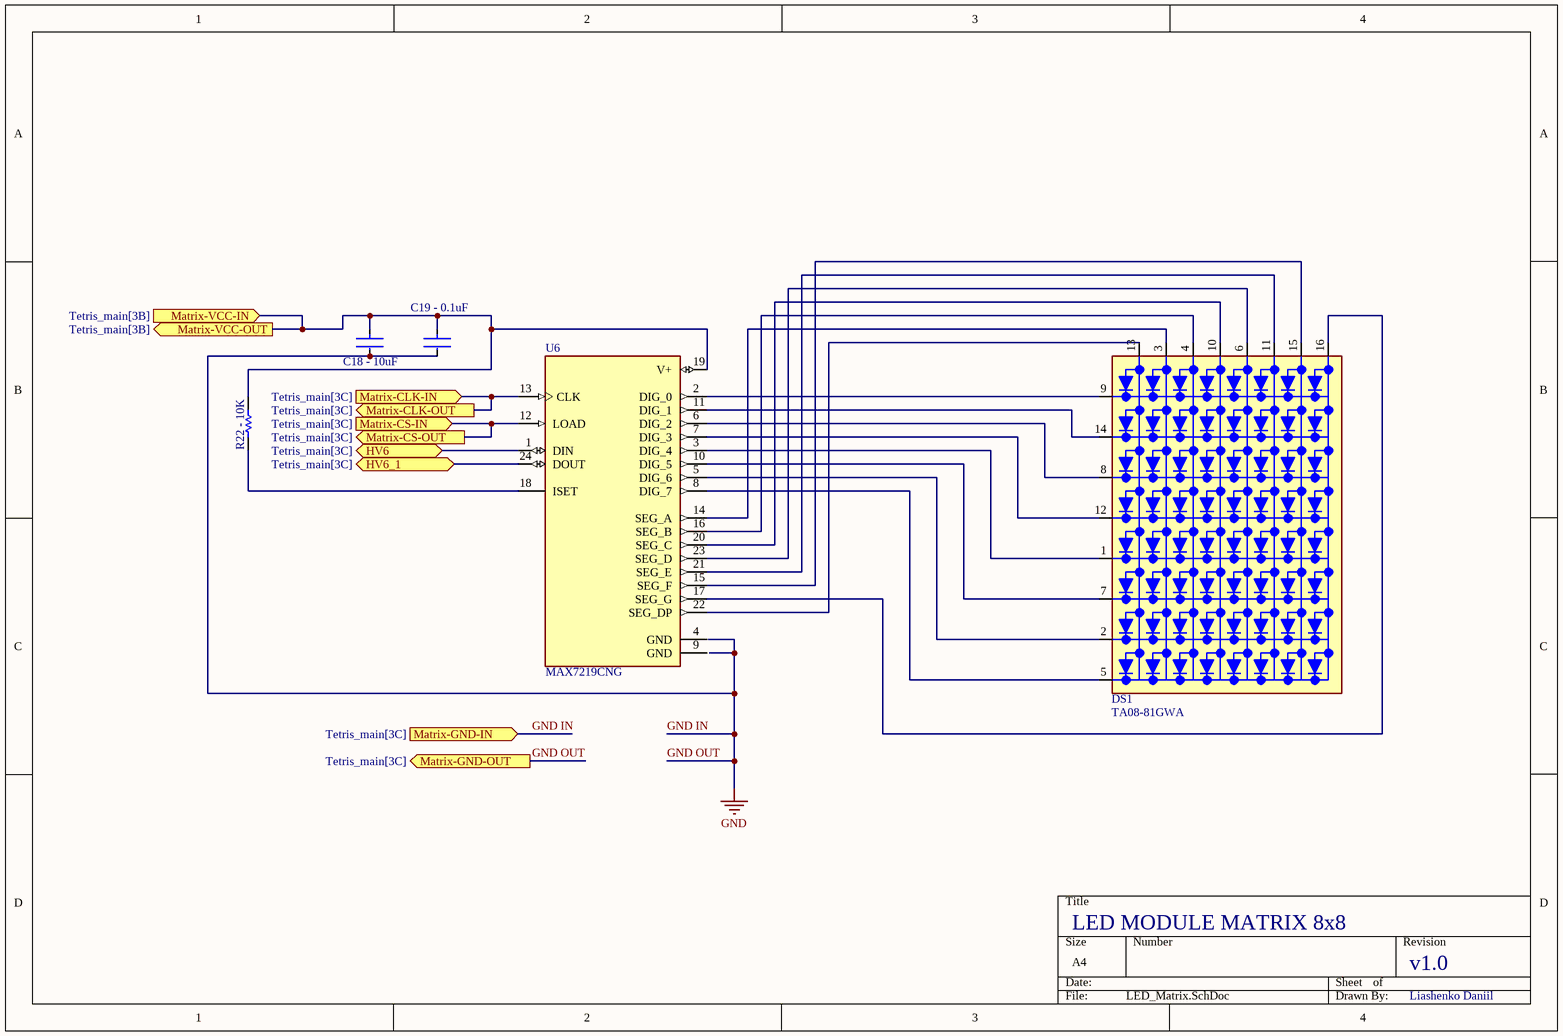
[diagram p3: LED_Matrix.SchDoc]

### Parts
C18_-_10uF  GRM188R60J106ME47D  [FP-GRM188-0_1-e0_2_0_55-IPC_A]  (value not drawn)
C19_-_0.1uF  CC0603KRX7R7BB104  [FP-CC0603-DA-MFG]  (value not drawn)
DS1  TA08-81GWA  [DISPLAY_TA08-81GWA]
R22_-_10K  RC0603JR-074K7L  [RESC1608X55X25ML10T15]  (value not drawn)
U6  MAX7219CNG  [DIP762W47P254L3054H457Q24B]

### Ports
HV6 (bidir, see Tetris_main[3C]), HV6_1 (bidir, see Tetris_main[3C]), Matrix-CLK-IN (in, see Tetris_main[3C]), Matrix-CLK-OUT (out, see Tetris_main[3C]), Matrix-CS-IN (in, see Tetris_main[3C]), Matrix-CS-OUT (out, see Tetris_main[3C]), Matrix-GND-IN (in, see Tetris_main[3C]), Matrix-GND-OUT (out, see Tetris_main[3C]), Matrix-VCC-IN (in, see Tetris_main[3B]), Matrix-VCC-OUT (out, see Tetris_main[3B])

### Nets
GND IN: C18_-_10uF.2 C19_-_0.1uF.2 ; port Matrix-GND-IN, port Matrix-GND-OUT  [also labelled GND, GND OUT]
HV6: U6.1(DIN) ; port HV6
HV6_1: U6.24(DOUT) ; port HV6_1
Matrix-CLK-IN: U6.13(CLK) ; port Matrix-CLK-IN, port Matrix-CLK-OUT
Matrix-CS-IN: U6.12(LOAD) ; port Matrix-CS-IN, port Matrix-CS-OUT
Matrix-VCC-IN: C18_-_10uF.1 C19_-_0.1uF.1 R22_-_10K.2 U6.19(V+) ; port Matrix-VCC-IN, port Matrix-VCC-OUT
NetDS1_1: DS1.1(CATHODE_ROW_5) U6.3(DIG_4)
NetDS1_2: DS1.2(CATHODE_ROW_7) U6.5(DIG_6)
NetDS1_3: DS1.3(ANODE_COLUMN_2) U6.14(SEG_A)
NetDS1_4: DS1.4(ANODE_COLUMN_3) U6.16(SEG_B)
NetDS1_5: DS1.5(CATHODE_ROW_8) U6.8(DIG_7)
NetDS1_6: DS1.6(ANODE_COLUMN_5) U6.23(SEG_D)
NetDS1_7: DS1.7(CATHODE_ROW_6) U6.10(DIG_5)
NetDS1_8: DS1.8(CATHODE_ROW_3) U6.6(DIG_2)
NetDS1_9: DS1.9(CATHODE_ROW_1) U6.2(DIG_0)
NetDS1_10: DS1.10(ANODE_COLUMN_4) U6.20(SEG_C)
NetDS1_11: DS1.11(ANODE_COLUMN_6) U6.21(SEG_E)
NetDS1_12: DS1.12(CATHODE_ROW_4) U6.7(DIG_3)
NetDS1_13: DS1.13(ANODE_COLUMN_1) U6.22(SEG_DP)
NetDS1_14: DS1.14(CATHODE_ROW_2) U6.11(DIG_1)
NetDS1_15: DS1.15(ANODE_COLUMN_7) U6.15(SEG_F)
NetDS1_16: DS1.16(ANODE_COLUMN_8) U6.17(SEG_G)
NetR22_-_10K_1: R22_-_10K.1 U6.18(ISET)

Not connected (* = marked no-connect by the designer): U6 4(GND) 9(GND)

### Channels
U_LED_Matrix_1: designators C18 - 10uF=C18_-_10uF_U_LED_Matrix_1 C19 - 0.1uF=C19_-_0.1uF_U_LED_Matrix_1 DS1=DS1_U_LED_Matrix_1 R22 - 10K=R22_-_10K_U_LED_Matrix_1 U6=U6_U_LED_Matrix_1; ports HV6=NetU6_U_LED_Matrix_1_1 HV6_1=NetU6_U_LED_Matrix_1_24 Matrix-CLK-IN=Matrix-CLK Matrix-CLK-OUT=Matrix-CLK Matrix-CS-IN=Matrix-CS Matrix-CS-OUT=Matrix-CS Matrix-GND-IN=GND Matrix-GND-OUT=GND Matrix-VCC-IN=+3.3V Matrix-VCC-OUT=+3.3V
U_LED_Matrix_2: designators C18 - 10uF=C18_-_10uF_U_LED_Matrix_2 C19 - 0.1uF=C19_-_0.1uF_U_LED_Matrix_2 DS1=DS1_U_LED_Matrix_2 R22 - 10K=R22_-_10K_U_LED_Matrix_2 U6=U6_U_LED_Matrix_2; ports HV6=HV6 HV6_1=NetU6_U_LED_Matrix_2_24 Matrix-CLK-IN=Matrix-CLK Matrix-CLK-OUT=Matrix-CLK Matrix-CS-IN=Matrix-CS Matrix-CS-OUT=Matrix-CS Matrix-GND-IN=GND Matrix-GND-OUT=GND Matrix-VCC-IN=+3.3V Matrix-VCC-OUT=+3.3V

### Notes on the sheet
- LED MODULE MATRIX 8x8
- v1.0
- Liashenko Daniil

### Library data of the parts
C18_-_10uF = CMP-2006-02792-2: as C1_-_10uF on sheet Tetris_main; Packaging: Tape and Reel; Voltage Rating (DC): 6.3V; Width: 0.031inch; Termination: SMD/SMT; Dielectric: X5R; Package Quantity: 4000; Voltage Rating: 6.3V; Capacitance: 10uF; Case/Package: 0603; Min Operating Temperature: -55°C; Voltage: 6.3V; Length: 1.6mm; Thickness: 0.035inch; Lead Free: Lead Free; Depth: 0.8mm; Case Code (Imperial): 0603; Max Operating Temperature: 85°C; Material: Ceramic; Height: 0.8mm; Tolerance: 20%; Mount: Surface Mount; REACH SVHC: No SVHC; Radiation Hardening: No; Case Code (Metric): 1608
C19_-_0.1uF = CMP-2000-05002-2: as C3_-_0.1uF on sheet Tetris_main; Voltage Rating: 16 V; Package: CC0603-DA; ComponentLink2Description: Datasheet; Octopart: https://octopart.com/cc0603krx7r7bb104-yageo-192941; Temperature Range High: +125°C; Digikey Description: CAP CER 0.1UF 16V X7R 0603; Voltage: 16 V; Device Class L2: Capacitors; Height: 0.9mm; Temperature: -55°C to +125°C; Manufacturer Part Number: CC0603KRX7R7BB104; Device Class L1: Passive Components; Device Class L3: Ceramic Capacitors; ComponentLink2URL: http://www.yageo.com/documents/recent/UPY-GPHC_X7R_6.3V-to-50V_18.pdf; Footprint Url: http://www.yageo.com/exep/pages/download/literatures/UPY-C_GEN_24.pdf; RoHS: TRUE; Temperature Range Low: -55°C; Temperature Characteristic: X7R; Lead Free: Yes; Capacitance: 100 nF; Category: Cap; Mouser Description: Multilayer Ceramic Capacitor, CC Series, 0.1 - F, - 10%, X7R, 16 V, 0603 [1608 Metric]; Automotive: No
DS1 = CMP-007-00037-1: DISPLAY, DOT MATRIX, 0.8, 8X8, GREEN; Display Dots x Lines: 8 x 8; LED Colour: Gr; MF: Kingbright; Case/Package: DIP-16 Kingbright; Price: None; SnapEDA_Link: https://www.snapeda.com/parts/TA08-81GWA/Kingbright/view-part/?ref=snap; Design Item ID: TA08-81GWA; MP: TA08-81GWA; Check_prices: https://www.snapeda.com/parts/TA08-81GWA/Kingbright/view-part/?ref=eda; Availability: Not in stock; Value: *; Pins: 16; Component Type: Standard; Source: TA08-81GWA.SchLib
R22_-_10K = CMP-2000-05024-1: as R11_-_4.7K on sheet Tetris_main; Operating Temperature Range: -55Cto+155C; Case Code - mm: 1608; Tolerance: 5%; Product: ThickFilmResistorsGeneralPurpose; Case Code - in: 0603; Datasheet URL: http://www.yageo.com/documents/recent/PYu-RC_Group_51_RoHS_L_04.pdf; Package Reference: 603; Datasheet Version: Rev. 4, 02/2016; Package Description: 2-Pin Surface Mount Device, Body 1.6 x 0.8 mm; Manufacturer URL: http://www.yageo.com/; Series: RC; Packaging: Reel; Termination Style: SMD/SMT
U6 = CMP-051-000000-9: Value: *; Component Type: Standard; MP: MAX7219CNG; Package: None; Availability: Unavailable; Source: MAX7219CNG.SchLib; Price: None; Pin Count: 24; Design Item ID: MAX7219CNG

## Nets that join several sheets
+3.3V: Tetris_main (33 pins), Logic_Converter (12 pins), OLED_128x32 (11 pins), U_LED_Matrix_1 (C18_-_10uF_U_LED_Matrix_1.1 C19_-_0.1uF_U_LED_Matrix_1.1 R22_-_10K_U_LED_Matrix_1.2 U6_U_LED_Matrix_1.19), U_LED_Matrix_2 (C18_-_10uF_U_LED_Matrix_2.1 C19_-_0.1uF_U_LED_Matrix_2.1 R22_-_10K_U_LED_Matrix_2.2 U6_U_LED_Matrix_2.19)
GND: Tetris_main (45 pins), Logic_Converter (6 pins), OLED_128x32 (9 pins), U_LED_Matrix_1 (C18_-_10uF_U_LED_Matrix_1.2 C19_-_0.1uF_U_LED_Matrix_1.2), U_LED_Matrix_2 (C18_-_10uF_U_LED_Matrix_2.2 C19_-_0.1uF_U_LED_Matrix_2.2)
HV1: Tetris_main (R15_-_10K.1 U8.A), Logic_Converter (Q1.3 R24_-_10K.1)
HV2: Tetris_main (R16_-_10K.1 U8.B), Logic_Converter (Q5.3 R32_-_10K.1)
HV3: Tetris_main (U8.3), Logic_Converter (Q3.3 R29_-_10K.1)
HV6: Logic_Converter (Q6.3 R34_-_10K.1), U_LED_Matrix_2 (U6_U_LED_Matrix_2.1)
LV1: Tetris_main (U1.5), Logic_Converter (Q1.2 R23_-_10K.1)
LV2: Tetris_main (U1.6), Logic_Converter (Q5.2 R31_-_10K.1)
LV3: Tetris_main (U1.10), Logic_Converter (Q3.2 R28_-_10K.1)
LV4: Tetris_main (U1.15), Logic_Converter (Q4.2 R27_-_10K.1)
LV5: Tetris_main (U1.16), Logic_Converter (Q2.2 R25_-_10K.1)
LV6: Tetris_main (U1.17), Logic_Converter (Q6.2 R33_-_10K.1)
Matrix-CLK: Logic_Converter (Q4.3 R30_-_10K.1), U_LED_Matrix_1 (U6_U_LED_Matrix_1.13), U_LED_Matrix_2 (U6_U_LED_Matrix_2.13)
Matrix-CS: Logic_Converter (Q2.3 R26_-_10K.1), U_LED_Matrix_1 (U6_U_LED_Matrix_1.12), U_LED_Matrix_2 (U6_U_LED_Matrix_2.12)
SCL OLED: Tetris_main (U1.12), OLED_128x32 (D2.10 R18_-_4.7K.2)
SDA OLED: Tetris_main (U1.11), OLED_128x32 (D2.11 R19_-_4.7K.2)